# Altium project Motor Driver Board 2019-2020.PrjPcb (part 3 of 3)

## Sheet Connectors and Inputs.SchDoc: Connectors and Inputs
size A4; Organization: UOE Racing; Address1: University of Ottawa; Address2: Camry M; Address3: &; Address4: Nick M; DocumentNumber: 2020; Revision: A; SheetNumber: 4; SheetTotal: 4
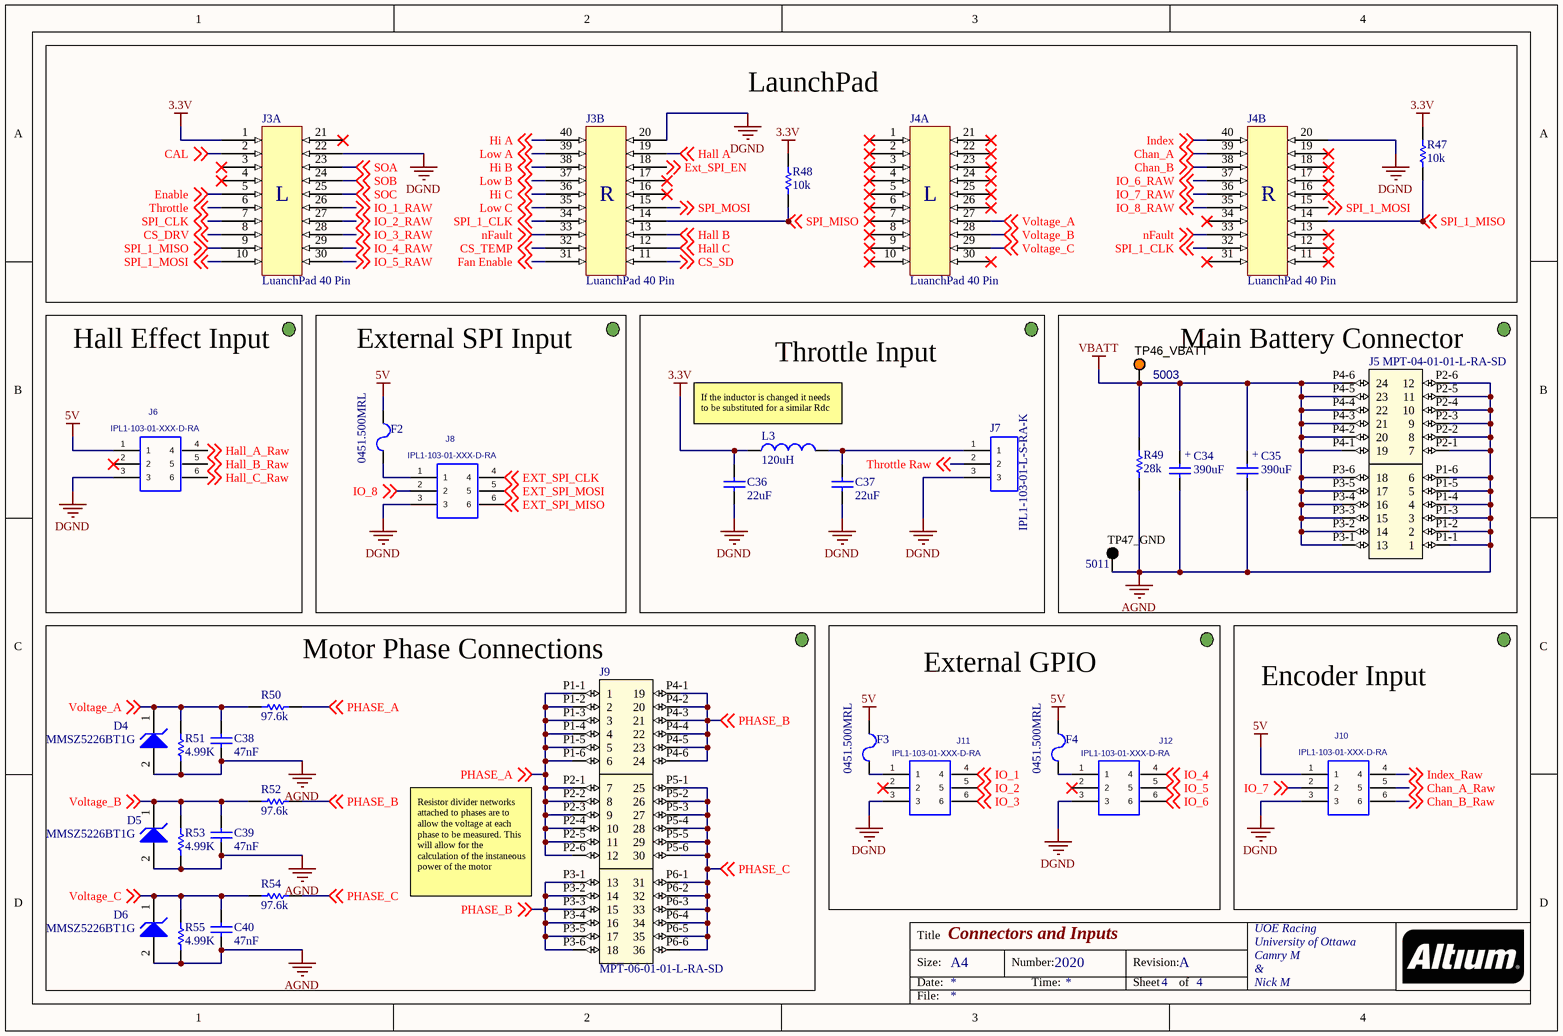
[diagram p2: Connectors and Inputs.SchDoc]

### Parts
C34  390uF  [EGPD800ELL391MK25H]
C35  390uF  [EGPD800ELL391MK25H]
C36  22uF  [CAPC2013X145X50ML20T25]
C37  22uF  [CAPC2013X145X50ML20T25]
C38  47nF  [CAPC1608X05L]
C39  47nF  [CAPC1608X05L]
C40  47nF  [CAPC1608X05L]
D4  MMSZ5226BT1G  [ONSC-SOD-123-2-425-04_V]
D5  MMSZ5226BT1G  [ONSC-SOD-123-2-425-04_V]
D6  MMSZ5226BT1G  [ONSC-SOD-123-2-425-04_V]
F2  0451.500MRL  [LFUS-45X_V]
F3  0451.500MRL  [LFUS-45X_V]
F4  0451.500MRL  [LFUS-45X_V]
J3  LuanchPad 40 Pin  [TI LuanchPad]  (parts A,B of 2)
J4  LuanchPad 40 Pin  [TI LuanchPad]  (parts A,B of 2)
J5  MPT-04-01-01-L-RA-SD  [*MPT-04-01-XX-X-RA-SD]
J6  IPL1-103-01-XXX-D-RA  [IPL1-103-01-XXX-D-RA]
J7  IPL1-103-01-L-S-RA-K  [IPL1-103-01-XXX-S-RA]
J8  IPL1-103-01-XXX-D-RA  [IPL1-103-01-XXX-D-RA]
J9  MPT-06-01-01-L-RA-SD  [*MPT-06-01-XX-X-RA-SD]
J10  IPL1-103-01-XXX-D-RA  [IPL1-103-01-XXX-D-RA]
J11  IPL1-103-01-XXX-D-RA  [IPL1-103-01-XXX-D-RA]
J12  IPL1-103-01-XXX-D-RA  [IPL1-103-01-XXX-D-RA]
L3  120uH  [INDM125100X60N]
R47  10k  [CAPC1608X05L]
R48  10k  [CAPC1608X05L]
R49  28k  [CAPC1608X05L]
R50  97.6k  [RESC1608X55X30NL15T15]
R51  4.99K  [CAPC1608X05L]
R52  97.6k  [RESC1608X55X30NL15T15]
R53  4.99K  [CAPC1608X05L]
R54  97.6k  [RESC1608X55X30NL15T15]
R55  4.99K  [CAPC1608X05L]
TP46_VBATT  5003  [KSTN-5003]
TP47_GND  5011  [KSTN-5011_V]

### Blocks framed on the sheet
LaunchPad: J3 J4 R47 R48
Hall Effect Input: J6
External SPI Input: F2 J8
Throttle Input: C36 C37 J7 L3
Main Battery Connector: C34 C35 J5 R49 TP46_VBATT TP47_GND
Motor Phase Connections: C38-C40 D4-D6 J9 R50-R55
External GPIO: F3 F4 J11 J12
Encoder Input: J10

### Nets
3.3V: C36.2 J3.1 L3.1 R47.2 R48.2
5V: F2.2 F3.2 F4.2 J6.1 J10.1
AGND: C34.2 C35.2 C36.1 C37.1 C38.1 C39.1 C40.1 D4.2(A) D5.2(A) D6.2(A) J3.20 J3.22 J4.20 J5.P1-1(1) J5.P1-2(2) J5.P1-3(3) J5.P1-4(4) J5.P1-5(5) J5.P1-6(6) J5.P2-1(7) J5.P2-2(8) J5.P2-3(9) J5.P2-4(10) J5.P2-5(11) J5.P2-6(12) J6.3 J7.3 J8.3 J10.3 J11.3 J12.3 R49.1 R51.1 R53.1 R55.1 TP47_GND.1  [also labelled DGND]
VBATT: C34.1 C35.1 J5.P3-1(13) J5.P3-2(14) J5.P3-3(15) J5.P3-4(16) J5.P3-5(17) J5.P3-6(18) J5.P4-1(19) J5.P4-2(20) J5.P4-3(21) J5.P4-4(22) J5.P4-5(23) J5.P4-6(24) R49.2 TP46_VBATT.1
CAL: J3.2 ; off-sheet CAL
Chan_A: J4.39 ; off-sheet Chan_A
Chan_A_Raw: J10.5 ; off-sheet Chan_A_Raw
Chan_B: J4.38 ; off-sheet Chan_B
Chan_B_Raw: J10.6 ; off-sheet Chan_B_Raw
CS_DRV: J3.8 ; off-sheet CS_DRV
CS_SD: J3.11 ; off-sheet CS_SD
CS_TEMP: J3.32 ; off-sheet CS_TEMP
Enable: J3.5 ; off-sheet Enable
EXT_SPI_CLK: J8.4 ; off-sheet EXT_SPI_CLK
Ext_SPI_EN: J3.18 ; off-sheet Ext_SPI_EN
EXT_SPI_MISO: J8.6 ; off-sheet EXT_SPI_MISO
EXT_SPI_MOSI: J8.5 ; off-sheet EXT_SPI_MOSI
Fan Enable: J3.31 ; off-sheet Fan Enable
Hall A: J3.19 ; off-sheet Hall A
Hall B: J3.13 ; off-sheet Hall B
Hall C: J3.12 ; off-sheet Hall C
Hall_A_Raw: J6.4 ; off-sheet Hall_A_Raw
Hall_B_Raw: J6.5 ; off-sheet Hall_B_Raw
Hall_C_Raw: J6.6 ; off-sheet Hall_C_Raw
Hi A: J3.40 ; off-sheet Hi A
Hi B: J3.38 ; off-sheet Hi B
Hi C: J3.36 ; off-sheet Hi C
Index: J4.40 ; off-sheet Index
Index_Raw: J10.4 ; off-sheet Index_Raw
IO_1: J11.4 ; off-sheet IO_1
IO_1_RAW: J3.26 ; off-sheet IO_1_RAW
IO_2: J11.5 ; off-sheet IO_2
IO_2_RAW: J3.27 ; off-sheet IO_2_RAW
IO_3: J11.6 ; off-sheet IO_3
IO_3_RAW: J3.28 ; off-sheet IO_3_RAW
IO_4: J12.4 ; off-sheet IO_4
IO_4_RAW: J3.29 ; off-sheet IO_4_RAW
IO_5: J12.5 ; off-sheet IO_5
IO_5_RAW: J3.30 ; off-sheet IO_5_RAW
IO_6: J12.6 ; off-sheet IO_6
IO_6_RAW: J4.37 ; off-sheet IO_6_RAW
IO_7: J10.2 ; off-sheet IO_7
IO_7_RAW: J4.36 ; off-sheet IO_7_RAW
IO_8: J8.2 ; off-sheet IO_8
IO_8_RAW: J4.35 ; off-sheet IO_8_RAW
Low A: J3.39 ; off-sheet Low A
Low B: J3.37 ; off-sheet Low B
Low C: J3.35 ; off-sheet Low C
nFault: J3.33 J4.33 ; off-sheet nFault
PHASE_A: J9.P1-1(1) J9.P1-2(2) J9.P1-3(3) J9.P1-4(4) J9.P1-5(5) J9.P1-6(6) J9.P2-1(7) J9.P2-2(8) J9.P2-3(9) J9.P2-4(10) J9.P2-5(11) J9.P2-6(12) R50.2 ; off-sheet PHASE_A
PHASE_B: J9.P3-1(13) J9.P3-2(14) J9.P3-3(15) J9.P3-4(16) J9.P3-5(17) J9.P3-6(18) J9.P4-1(19) J9.P4-2(20) J9.P4-3(21) J9.P4-4(22) J9.P4-5(23) J9.P4-6(24) R52.2 ; off-sheet PHASE_B
PHASE_C: J9.P5-1(25) J9.P5-2(26) J9.P5-3(27) J9.P5-4(28) J9.P5-5(29) J9.P5-6(30) J9.P6-1(31) J9.P6-2(32) J9.P6-3(33) J9.P6-4(34) J9.P6-5(35) J9.P6-6(36) R54.2 ; off-sheet PHASE_C
SOA: J3.23 ; off-sheet SOA
SOB: J3.24 ; off-sheet SOB
SOC: J3.25 ; off-sheet SOC
SPI_1_CLK: J3.34 J4.32 ; off-sheet SPI_1_CLK
SPI_1_MISO: J3.9 J4.14 R47.1 ; off-sheet SPI_1_MISO
SPI_1_MOSI: J3.10 J4.15 ; off-sheet SPI_1_MOSI
SPI_CLK: J3.7 ; off-sheet SPI_CLK
SPI_MISO: J3.14 R48.1 ; off-sheet SPI_MISO
SPI_MOSI: J3.15 ; off-sheet SPI_MOSI
Throttle: J3.6 ; off-sheet Throttle
Throttle Raw: J7.2 ; off-sheet Throttle Raw
Voltage_A: C38.2 D4.1(K) J4.27 R50.1 R51.2 ; off-sheet Voltage_A
Voltage_B: C39.2 D5.1(K) J4.28 R52.1 R53.2 ; off-sheet Voltage_B
Voltage_C: C40.2 D6.1(K) J4.29 R54.1 R55.2 ; off-sheet Voltage_C
NetC37_2: C37.2 J7.1 L3.2
NetF2_1: F2.1 J8.1
NetF3_1: F3.1 J11.1
NetF4_1: F4.1 J12.1

Not connected (* = marked no-connect by the designer): J3 3* 4* 16* 17* 21*; J4 1* 2* 3* 4* 5* 6* 7* 8* 9* 10* 11* 12* 13* 16* 17* 18* 19* 21* 22* 23* 24* 25* 26* 30* 31* 34*; J6 2*; J11 2*; J12 2*

### Notes on the sheet
- (near L3) If the inductor is changed it needs to be substituted for a similar Rdc
- Resistor divider networks attached to phases are to allow the voltage at each phase to be measured. This will allow for the calculation of the instaneous power of the motor
- Title
- Size:
- Date:
- A4
- Number:
- Time:
- Revision:
- Sheet
- of
- File:
- (in symbol EGPD800ELL391MK25H) +
- (in symbol LuanchPad 40 Pin, part A) L
- (in symbol LuanchPad 40 Pin, part B) R

### Library data of the parts
C34 C35 = EGPD800ELL391MK25H: CAP ALUM 390UF 20% 80V RADIAL; Manufacturer 1: United Chemi-Con; ESR (Equivalent Series Resistance): 52mR; Ripple Current: 2.05A; Life (Hours): 3000Hour; Lead/Base Style: Straight; Supplier 1: Digi-Key; Manufacturer Part Number 1: EGPD800ELL391MK25H; Stock 1: 4261; Pricing 1: 1=1.62000, 10=1.28300, 100=0.96200, 500=0.72684, 1000=0.64133, 2500=0.59857, 5000=0.58147 (USD); RoHS: Yes; Mount: Through Hole; Case/Package: Radial; Min Operating Temperature: -40°C; Max Operating Temperature: 135°C; Capacitance: 390uF; Package Quantity: 1000; Packaging: Bulk; Voltage Rating: 80V; Tolerance: 20%; Termination: Radial; Voltage Rating (DC): 80V; Diameter: 12.5mm; Length: 25mm; Height: 12.5mm; Lead Pitch: 0.197inch; Height - Seated (Max): 1.043inch; Width: 12.5mm; ComponentLink1URL: https://datasheet.ciiva.com/31836/76cat-db-al-cgieejppdfnamegpd-cgieejppdfnamegpd-31836902.pdf?src-supplier=Onlinecomponents.com; ComponentLink1Description: https://datasheet.ciiva.com/31836/76cat-db-al-cgieejppdfnamegpd-cgieejppdfnamegpd-31836902.pdf?src-supplier=Onlinecomponents.com; ClassName: FETBridge
C36 C37 = CMP-2007-01021-1: Part Number: C0805C226M9PAC7800; Manufacturer: Kemet; ClassName: Throttle
C38-C40 = C0603C473K5RACTU: Multilayer Ceramic Capacitor, C Series, 0.047 - F, - 10%, X7R, 50 V, 0603 [1608 Metric] ;RoHS Compliant: Yes; Manufacturer 1: KEMET; Voltage Rating: 50V; Dissipation Factor: 2.5%; Supplier 1: Digi-Key; Manufacturer Part Number 1: C0603C473K5RACTU; Stock 1: 340857; Pricing 1: 1=0.12000, 10=0.08800, 100=0.04130, 500=0.02896, 1000=0.02397 (USD); RoHS: Yes; Mount: Surface Mount,PCB; Case/Package: 0603; Number of Pins: 2; Case Code (Metric): 1608; Case Code (Imperial): 0603; Dielectric Material: Ceramic; Min Operating Temperature: -55°C; Max Operating Temperature: 125°C; Packaging: Tape and Reel; Tolerance: 10%; Package Quantity: 1; Capacitance: 47nF; Voltage Rating (DC): 50V; Dielectric: X7R; Termination: SMD/SMT; Voltage: 50V; Length: 1.6mm; Height: 0.8mm; Width: 0.8mm; Thickness: 0.034inch; Lead Pitch: 0.7mm; Depth: 0.8mm; Radiation Hardening: No; REACH SVHC: No SVHC; ComponentLink1URL: https://datasheet.ciiva.com/6074/1776093-6074329.pdf?src-supplier=Farnell; ComponentLink1Description: https://datasheet.ciiva.com/6074/1776093-6074329.pdf?src-supplier=Farnell; ComponentLink2URL: https://datasheet.ciiva.com/28682/1851736-28682298.pdf?src-supplier=Element14; ComponentLink2Description: https://datasheet.ciiva.com/28682/1851736-28682298.pdf?src-supplier=Element14; ComponentLink3URL: https://datasheet.ciiva.com/7823/1776093-7823803.pdf?src-supplier=Element14; ComponentLink3Description: https://datasheet.ciiva.com/7823/1776093-7823803.pdf?src-supplier=Element14; ComponentLink4URL: https://datasheet.ciiva.com/18193/getdatasheetpartid-94279-18193115.pdf?src-supplier=Verical; ComponentLink4Description: https://datasheet.ciiva.com/18193/getdatasheetpartid-94279-18193115.pdf?src-supplier=Verical; ComponentLink5URL: https://datasheet.ciiva.com/7823/1776093-7823804.pdf?src-supplier=Element14; ComponentLink5Description: https://datasheet.ciiva.com/7823/1776093-7823804.pdf?src-supplier=Element14; ClassName: Vfeedback
D4-D6 = CMP-1060-00363-1: Zener Voltage Regulator, 500 mW, 2-Pin SOD-123, Pb-Free, Tape and Reel; Manufacturer: On Semiconductor; P Max (W): 0.5; VZ Typ (V): 3.3; PartNumber: MMSZ5226BT1G; ComponentLink1Description: Manufacturer URL; ComponentLink3URL: http://www.onsemi.com/pub_link/Collateral/425-04.PDF; ComponentLink3Description: Package Specification; ComponentLink2Description: Datasheet; ComponentLink1URL: http://www.onsemi.com/; Mounting Technology: Surface Mount; Packing: Tape and Reel; PackageDescription: 2-Pin SOD, Body 1.6 x 2.69 mm; ComponentLink2URL: http://www.onsemi.com/pub_link/Collateral/MMSZ5221BT1-D.PDF; RoHS: Pb-Free; PackageVersion: Rev. G, 10/2009; PackageReference: SOD-123-2-425-04; DatasheetVersion: Rev. 12; ClassName: Vfeedback
F2-F4 = CMP-2000-05631-1: Fuse, 125 V, 500 mA, -55 to 125 degC, 2-Pin SMD, RoHS, Tape and Reel; Manufacturer: Littelfuse; Working Voltage-Max: 125V; Response Characteristic: VeryFastActing; Current Rating: 0.5A; Datasheet Version: 02/2016; Package Description: 2-Pin Surface Mount Device, Body 6.1 x 2.69 mm; Package Reference: 45X; Manufacturer URL: http://www.littelfuse.com/; Mounting Technology: SurfaceMount; Size: 6.10x2.69mm; Operating Temp Range: -55to+125°C; Datasheet URL: http://www.littelfuse.com/products/fuses/surface-mount-fuses/nano-2-fuses/~/media/electronics/datasheets/fuses/littelfuse_fuse_451_453_datasheet.pdf.pdf
J3 J4 = LuanchPad 40 Pin: Designed to fit a TI luanchpad board or expansion board
J5 = MPT-04-01-01-L-RA-SD: SAMTEC - MPT-04-01-01-L-RA-SD - HEADER, 4WAY, POWER, R/A; Current Rating: 34.8A; Voltage Rating: 848V; Number of Contacts: 4; Number of Ports: 1; Max Voltage Rating (AC): 600V; Gender: Male; Pitch: 5mm; Supplier 1: Digi-Key; Manufacturer 1: Samtec; Manufacturer Part Number 1: MPT-04-01-01-L-RA-SD; Stock 1: 186; Pricing 1: 1=5.98000, 48=5.25792, 144=4.78000, 528=4.06299, 1008=3.46550 (USD); RoHS: Yes; Mount: Through Hole; Contact Plating: Gold; Contact Material: Copper Alloy,Copper; Number of Terminals: 32; Housing Material: Polymer; Min Operating Temperature: -55°C; Max Operating Temperature: 125°C; Number of Rows: 1; Packaging: Bulk; Termination: Solder; Orientation: Right Angle; Length: 31.36mm; Lead Pitch: 5mm; Depth: 14.81mm; Radiation Hardening: No; REACH SVHC: No SVHC; ComponentLink1URL: https://datasheet.ciiva.com/7997/452746-7997632.pdf?src-supplier=Element14; ComponentLink1Description: https://datasheet.ciiva.com/7997/452746-7997632.pdf?src-supplier=Element14; ComponentLink2URL: https://datasheet.ciiva.com/25617/0900766b81157edd-25617154.pdf?src-supplier=RSComponents; ComponentLink2Description: https://datasheet.ciiva.com/25617/0900766b81157edd-25617154.pdf?src-supplier=RSComponents; ComponentLink3URL: https://datasheet.ciiva.com/9446/mps-ra-9446008.pdf?src-supplier=Avnet; ComponentLink3Description: https://datasheet.ciiva.com/9446/mps-ra-9446008.pdf?src-supplier=Avnet; ClassName: FETBridge
J6 J8 J10-J12 = IPL1-103-01-XXX-D-RA: Terminal Assembly, Double Row, Right Angle, Thru-Hole, 0.100" x 0.100" Pitch, 6Pins; MANUFACTURER: SAMTEC; CREATED: July 16, 2014 - Wendy Xin; PCB DECAL: IPL1-103-01-XXX-D-RA
J7 = IPL1-103-01-L-S-RA-K: CONN HEADER R/A 3POS 2.54MM; Manufacturer 1: Samtec; Max Current Rating: 7.4A; Number of Contacts: 3; Number of Ports: 1; Max Voltage Rating (AC): 675V; Gender: Male; Supplier 1: Digi-Key; Manufacturer Part Number 1: IPL1-103-01-L-S-RA-K; Stock 1: 209; Pricing 1: 1=2.59000, 10=2.34700, 100=2.01180, 500=1.67650, 1000=1.43700, 5000=1.27414 (USD); RoHS: Yes; Mount: Through Hole; Contact Material: Bronze; Contact Plating: Gold; Number of Terminals: 3; Housing Material: Polymer; Min Operating Temperature: -55°C; Max Operating Temperature: 125°C; Termination: Solder; Orientation: Right Angle; Packaging: Bulk; Length: 9.14mm; Pitch: 2.54mm; Depth: 9.65mm; Radiation Hardening: No; ComponentLink1URL: http://www.farnell.com/datasheets/2607185.pdf?src-supplier=Farnell; ComponentLink1Description: http://www.farnell.com/datasheets/2607185.pdf?src-supplier=Farnell; ComponentLink2URL: http://components.arrow.com/part/dataview/0323_03818136?src-supplier=Arrow+Europe; ComponentLink2Description: http://components.arrow.com/part/dataview/0323_03818136?src-supplier=Arrow+Europe; ComponentLink3URL: http://www.samtec.com/documents/webfiles/pdf/ipl1.pdf?src-supplier=Avnet+Europe; ComponentLink3Description: http://www.samtec.com/documents/webfiles/pdf/ipl1.pdf?src-supplier=Avnet+Europe; ComponentLink4URL: http://www.samtec.com/documents/webfiles/pdf/ipl1.pdf?src-supplier=Avnet; ComponentLink4Description: http://www.samtec.com/documents/webfiles/pdf/ipl1.pdf?src-supplier=Avnet; ComponentLink5URL: http://www.farnell.com/datasheets/2607185.pdf?src-supplier=Newark; ComponentLink5Description: http://www.farnell.com/datasheets/2607185.pdf?src-supplier=Newark; ComponentLink6URL: http://suddendocs.samtec.com/prints/ipl1-1xx-xx-xxx-s-xx-x-xx-mkt.pdf?src-supplier=Digi-Key; ComponentLink6Description: http://suddendocs.samtec.com/prints/ipl1-1xx-xx-xxx-s-xx-x-xx-mkt.pdf?src-supplier=Digi-Key
J9 = MPT-06-01-01-L-RA-SD: Conn Mini-Power Terminal Strip HDR 6 POS Solder RA Thru-Hole 36 Terminal 1 Port; pin to pad: P1-1>1 P1-2>2 P1-3>3 P1-4>4 P1-5>5 P1-6>6 P2-1>7 P2-2>8 P2-3>9 P2-4>10 P2-5>11 P2-6>12 P3-1>13 P3-2>14 P3-3>15 P3-4>16 P3-5>17 P3-6>18 P4-1>19 P4-2>20 P4-3>21 P4-4>22 P4-5>23 P4-6>24 P5-1>25 P5-2>26 P5-3>27 P5-4>28 P5-5>29 P5-6>30 P6-1>31 P6-2>32 P6-3>33 P6-4>34 P6-5>35 P6-6>36; Manufacturer 1: Samtec; Number of Contacts: 6; Voltage Rating: 848V; Number of Ports: 1; Max Voltage Rating (AC): 600V; Gender: Male; Pitch: 5mm; Supplier 1: Digi-Key; Manufacturer Part Number 1: MPT-06-01-01-L-RA-SD; Stock 1: 373; Pricing 1: 1=7.27000, 48=6.36292, 144=5.75701, 528=4.84799, 1008=4.24200 (USD); RoHS: Yes; Mount: Through Hole; Contact Material: Copper Alloy,Copper; Contact Plating: Gold; Number of Terminals: 36; Housing Material: Polymer; Min Operating Temperature: -55°C; Max Operating Temperature: 125°C; Termination: Solder; Orientation: Right Angle; Packaging: Bulk; Number of Rows: 1; Lead Pitch: 5mm; Depth: 14.81mm; Radiation Hardening: No; REACH SVHC: No SVHC; ComponentLink1URL: https://datasheet.ciiva.com/25617/0900766b81157edd-25617181.pdf?src-supplier=RSComponents; ComponentLink1Description: https://datasheet.ciiva.com/25617/0900766b81157edd-25617181.pdf?src-supplier=RSComponents; ComponentLink2URL: https://datasheet.ciiva.com/16677/mps-ra-16677806.pdf?src-supplier=Avnet+Europe; ComponentLink2Description: https://datasheet.ciiva.com/16677/mps-ra-16677806.pdf?src-supplier=Avnet+Europe
L3 = DR125-124-R: Fixed Inductors 120 000uH 0.069A 150ohms; Manufacturer 1: Eaton Bussmann; Core Material: Ferrite; Tolerance: 20%; Shielding: Shielded; Saturation Current: 58A; Current Rating: 60mA; Inductance: 120mH; DC Resistance (DCR): 150R; Test Frequency: 100kHz; Current: 60A; Max DC Current: 69mA; Supplier 1: Digi-Key; Manufacturer Part Number 1: DR125-124-R; Stock 1: 1520; Pricing 1: 1=1.95000, 10=1.80100, 100=1.26060 (USD); RoHS: Yes; Mount: Surface Mount; Case/Package: 120; Number of Pins: 2; Weight: 0.016oz; Min Operating Temperature: -40°C; Max Operating Temperature: 125°C; Packaging: Tape and Reel; Package Quantity: 600; Termination: SMD/SMT; DC Current: 60mA; Military Standard: Not; Length: 12.5mm; Height: 6mm; Width: 0.492inch; Depth: 12.5mm; Lead Free: Lead Free; ComponentLink1URL: https://datasheet.ciiva.com/16291/4a32919a-7470-4ae0-be45-b59e3a1351ef-16291744.pdf?src-supplier=Future+Electronics; ComponentLink1Description: https://datasheet.ciiva.com/16291/4a32919a-7470-4ae0-be45-b59e3a1351ef-16291744.pdf?src-supplier=Future+Electronics; ComponentLink2URL: https://datasheet.ciiva.com/4958/bus-elx-ds-4315-dr-series-4958109.pdf?src-supplier=Mouser; ComponentLink2Description: https://datasheet.ciiva.com/4958/bus-elx-ds-4315-dr-series-4958109.pdf?src-supplier=Mouser
R47 R48 = RR0816P-103-D: RES SMD 10K OHM 0.5% 1/16W 0816; Manufacturer: Susumu; Resistance: 10kR; Power Rating: 63mW; Voltage Rating: 75V; Temperature Coefficient: 25ppm/°C; Supplier 1: Digi-Key; Manufacturer Part Number: RR0816P-103-D; Stock 1: 1031099; Pricing 1: 1=0.11, 10=0.098, 100=0.0376, 1000=0.01654, 2500=0.01428 (USD); Case/Package: 0603; Number of Pins: 2; Weight: 7.1E-05oz; Case Code (Imperial): 0603; Case Code (Metric): 1608; Min Operating Temperature: -55°C; Max Operating Temperature: 125°C; Packaging: Tape and Reel; Tolerance: 0.5%; Package Quantity: 1; Termination: SMD/SMT; Composition: Thin Film; Number of Terminations: 2; Max Power Dissipation: 63mW; Voltage Rating (DC): 75V; Length: 1.6mm; Height: 0.4mm; Width: 0.8mm; Depth: 0.8mm; REACH SVHC: Unknown; Lead Free: Lead Free; ComponentLink1URL: http://documents.rs-components.com/techlib://itc_doclist_GB.htm?stockno=3915321; ComponentLink1Description: http://documents.rs-components.com/techlib://itc_doclist_GB.htm?stockno=3915321; ComponentLink2URL: http://www.susumu.co.jp/common/pdf/n_catalog_partition05_en.pdf; ComponentLink2Description: http://www.susumu.co.jp/common/pdf/n_catalog_partition05_en.pdf
R49 = RMCF0603FT28K0: RES SMD 28K OHM 1% 1/10W 0603; Manufacturer 1: Stackpole Electronics; Resistance: 28kR; Power Rating: 100mW; Temperature Coefficient: 100ppm/°C; Supplier 1: Digi-Key; Manufacturer Part Number 1: RMCF0603FT28K0; Stock 1: 126187; Pricing 1: 1=0.10000, 10=0.01700, 100=0.00680, 1000=0.00306, 2500=0.00266 (USD); RoHS: Yes; Mount: Surface Mount; Case/Package: 0603; Case Code (Metric): 1608; Case Code (Imperial): 0603; Contact Plating: Tin,Matte; Min Operating Temperature: -55°C; Max Operating Temperature: 155°C; Tolerance: 1%; Packaging: Tape and Reel; Composition: Thick Film; Number of Terminations: 2; Max Power Dissipation: 100mW; Features: Automotive AEC-Q200; Length: 0.061inch; Height: 0.022inch; Width: 0.031inch; Radiation Hardening: No; Lead Free: Lead Free; ComponentLink1URL: https://www.seielect.com/Catalog/SEI-RMCF_RMCP.pdf?src-supplier=Digi-Key; ComponentLink1Description: https://www.seielect.com/Catalog/SEI-RMCF_RMCP.pdf?src-supplier=Digi-Key; ComponentLink2URL: https://www.seielect.com/catalog/SEI-Packaging.pdf?src-supplier=Digi-Key; ComponentLink2Description: https://www.seielect.com/catalog/SEI-Packaging.pdf?src-supplier=Digi-Key; ComponentLink3URL: http://components.arrow.com/part/dataview/50505137S2698N1174?src-supplier=Arrow; ComponentLink3Description: http://components.arrow.com/part/dataview/50505137S2698N1174?src-supplier=Arrow; ComponentLink4URL: https://www.seielect.com/catalog/SEI-RMCF_RMCP.pdf?src-supplier=Avnet; ComponentLink4Description: https://www.seielect.com/catalog/SEI-RMCF_RMCP.pdf?src-supplier=Avnet; ComponentLink5URL: http://www.seielect.com/Catalog/SEI-RMC.pdf?src-supplier=Future+Electronics; ComponentLink5Description: http://www.seielect.com/Catalog/SEI-RMC.pdf?src-supplier=Future+Electronics
R50 R52 R54 = CMP-2000-00697-1: Manufacturer: Panasonic; Part Number: ERJ-3EKF9762V; ClassName: Vfeedback
R51 R53 R55 = RT0603BRD074K99L: RES SMD 4.99K OHM 0.1% 1/10W; Manufacturer 1: Yageo; Resistance: 4.99kR; Temperature Coefficient: 25ppm/°C; Power Rating: 100mW; Voltage Rating: 75V; Voltage Rating (DC): 50V; Supplier 1: Digi-Key; Manufacturer Part Number 1: RT0603BRD074K99L; Stock 1: 53078; Pricing 1: 1=0.37000, 10=0.31200, 100=0.12190, 1000=0.05103, 2500=0.04678 (USD); RoHS: Yes; Case/Package: 0603; Weight: 7.1E-05oz; Contact Plating: Tin,Matte; Case Code (Metric): 1608; Case Code (Imperial): 0603; Min Operating Temperature: -55°C; Max Operating Temperature: 125°C; Tolerance: 0.1%; Composition: Thin Film; Package Quantity: 5000; Packaging: Tape and Reel; Number of Terminations: 2; Termination: SMD/SMT; Military Standard: Not; Max Power Dissipation: 100mW; Features: Moisture Resistant; Length: 1.6mm; Height: 0.022inch; Width: 0.031inch; Depth: 0.8mm; Radiation Hardening: No; Lead Free: Lead Free; ComponentLink1URL: https://datasheet.ciiva.com/2585/pyu-rt-1-to-0-05-rohs-l-4-2585984.pdf?src-supplier=Digi-Key; ComponentLink1Description: https://datasheet.ciiva.com/2585/pyu-rt-1-to-0-05-rohs-l-4-2585984.pdf?src-supplier=Digi-Key; ComponentLink2URL: https://datasheet.ciiva.com/46635/pyu-rt-1-to-0-05-rohs-l-5-46635030.pdf?src-supplier=Digi-Key; ComponentLink2Description: https://datasheet.ciiva.com/46635/pyu-rt-1-to-0-05-rohs-l-5-46635030.pdf?src-supplier=Digi-Key; ComponentLink3URL: https://datasheet.ciiva.com/12836/pyu-rt-1-to-0-05-rohs-l-4-12836462.pdf?src-supplier=Mouser; ComponentLink3Description: https://datasheet.ciiva.com/12836/pyu-rt-1-to-0-05-rohs-l-4-12836462.pdf?src-supplier=Mouser; ClassName: Vfeedback
TP46_VBATT = CMP-1672-00009-1: Test Point, Orange, 1-Pin THD, RoHS; Peak Reverse Current: 600 uA; Forward Current: 3 A; Max Surge Current: 80 A; Forward Voltage: 1.08 V; Max Operating Temperature: 150 degC; PackageReference: 5003; Pins: 2; ComponentLink2URL: http://keyelco.com/userAssets/file/M65p56.pdf; PackageDescription: 1-Pin Through Hole Device, Dia 2.54 mm; Weight: 0.01 lb; Diameter: 5.3 mm; Mount: Through Hole; Package Quantity: 500; Packaging: Bulk; Min Operating Temperature: -65 degC; ComponentLink1Description: Manufacturer URL; Height: 0.25 inch; ComponentLink1URL: http://www.keyelco.com/; ComponentLink2Description: Datasheet; Width: 0.25 inch; REACH SVHC: No SVHC; RoHSCompliant: true; Radiation Hardening: No; Length: 9.5 mm; DatasheetVersion: Jun-15
TP47_GND = CMP-1672-00003-4: Test Point, Black, Through Hole, RoHS, Bulk; Manufacturer: Keystone; ComponentLink2URL: http://www.keyelco.com/product-pdf.cfm?p=1320; Colour: Black; Pins: 1; REACH SVHC: No SVHC; ComponentLink1URL: http://www.keyelco.com/; PackageReference: 5011; Contact Plating: Silver; Package Quantity: 100; Packaging: Bulk; RoHSCompliant: true; Height: 8.12 mm; PackageDescription: 1-Pin Through Hole Device, Dia 3.17 mm; Mount: Through Hole; Mounting Technology: Through Hole; DatasheetVersion: Rev. F, 12/2013; ComponentLink1Description: Manufacturer URL; Contact Material: Bronze; ComponentLink2Description: Datasheet

## Sheet Title Page.SchDoc: Title Page
size A; Organization: UOE Racing; Address1: University of Ottawa; Address2: Camry M; Address3: &; Address4: Nick M; DocumentNumber: 2020; Revision: A; SheetNumber: 1; SheetTotal: 4
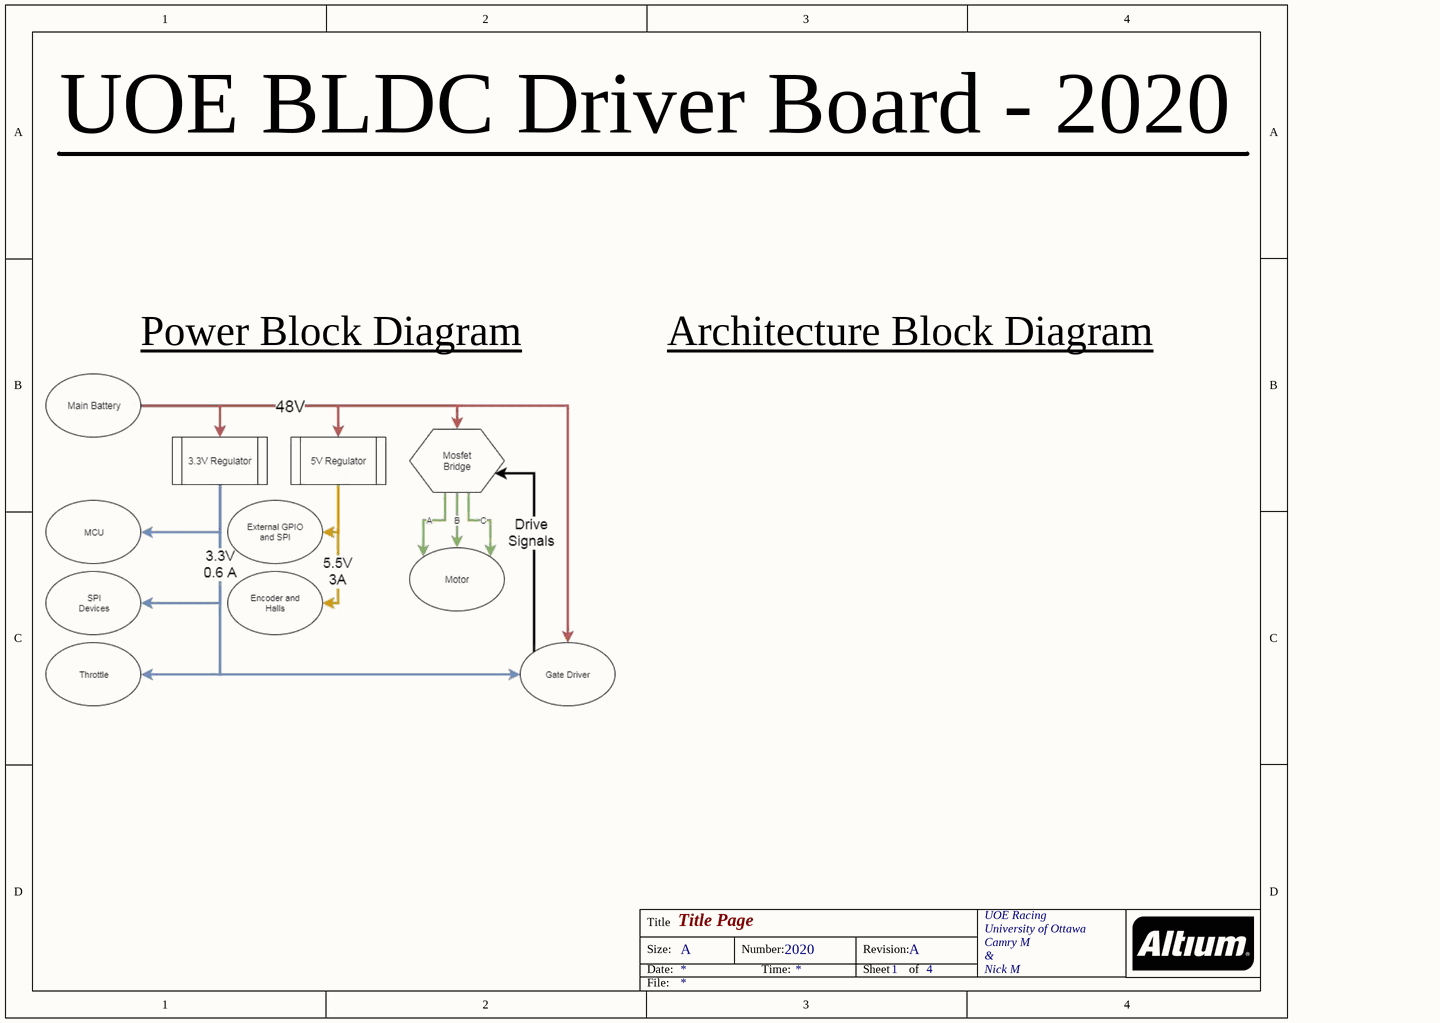
[diagram p3: Title Page.SchDoc]

### Notes on the sheet
- UOE BLDC Driver Board - 2020
- Power Block Diagram
- Architecture Block Diagram
- Title
- Size:
- Date:
- A
- Number:
- Time:
- Revision:
- Sheet
- of
- File:

## Nets that join several sheets
3.3V: Gate Driver and Power Section (13 pins), MCU and Digital Interfaces (17 pins), Connectors and Inputs (5 pins)
5V: Gate Driver and Power Section (11 pins), MCU and Digital Interfaces (13 pins), Connectors and Inputs (5 pins)
AGND: Gate Driver and Power Section (49 pins), MCU and Digital Interfaces (33 pins), Connectors and Inputs (36 pins)
VBATT: Gate Driver and Power Section (18 pins), Connectors and Inputs (16 pins)
CAL: Gate Driver and Power Section (R26.2 R43.1 U8.34), Connectors and Inputs (J3.2)
Chan_A_Raw: MCU and Digital Interfaces (U2.3), Connectors and Inputs (J10.5)
Chan_B_Raw: MCU and Digital Interfaces (U2.6), Connectors and Inputs (J10.6)
CS_DRV: Gate Driver and Power Section (R19.1 U8.32), Connectors and Inputs (J3.8)
CS_SD: Gate Driver and Power Section (R44.2), Connectors and Inputs (J3.11)
CS_TEMP: Gate Driver and Power Section (R20.1 U9.1), Connectors and Inputs (J3.32)
Enable: Gate Driver and Power Section (R18.2 R45.1 U8.33), MCU and Digital Interfaces (EN.1), Connectors and Inputs (J3.5)
EXT_SPI_CLK: MCU and Digital Interfaces (U5.13), Connectors and Inputs (J8.4)
Ext_SPI_EN: MCU and Digital Interfaces (R12.2 R13.1 U5.8), Connectors and Inputs (J3.18)
EXT_SPI_MISO: MCU and Digital Interfaces (U5.11), Connectors and Inputs (J8.6)
EXT_SPI_MOSI: MCU and Digital Interfaces (U5.12), Connectors and Inputs (J8.5)
Fan Enable: Gate Driver and Power Section (Q11.1 R42.2), Connectors and Inputs (J3.31)
Hall A: MCU and Digital Interfaces (HALLA.1 U7.3), Connectors and Inputs (J3.19)
Hall B: MCU and Digital Interfaces (HALLB.1 U7.6), Connectors and Inputs (J3.13)
Hall C: MCU and Digital Interfaces (HALLC.1 U7.8), Connectors and Inputs (J3.12)
Hall_A_Raw: MCU and Digital Interfaces (R14.1 U6.1), Connectors and Inputs (J6.4)
Hall_B_Raw: MCU and Digital Interfaces (R15.1 U6.3), Connectors and Inputs (J6.5)
Hall_C_Raw: MCU and Digital Interfaces (R16.1 U6.6), Connectors and Inputs (J6.6)
Hi A: Gate Driver and Power Section (U8.37), MCU and Digital Interfaces (HIA.1), Connectors and Inputs (J3.40)
Hi B: Gate Driver and Power Section (U8.39), MCU and Digital Interfaces (HIB.1), Connectors and Inputs (J3.38)
Hi C: Gate Driver and Power Section (U8.41), MCU and Digital Interfaces (HIC.1), Connectors and Inputs (J3.36)
Index_Raw: MCU and Digital Interfaces (U2.1), Connectors and Inputs (J10.4)
IO_1: MCU and Digital Interfaces (U3.20), Connectors and Inputs (J11.4)
IO_1_RAW: MCU and Digital Interfaces (U3.1), Connectors and Inputs (J3.26)
IO_2: MCU and Digital Interfaces (U3.18), Connectors and Inputs (J11.5)
IO_2_RAW: MCU and Digital Interfaces (U3.3), Connectors and Inputs (J3.27)
IO_3: MCU and Digital Interfaces (U3.17), Connectors and Inputs (J11.6)
IO_3_RAW: MCU and Digital Interfaces (U3.4), Connectors and Inputs (J3.28)
IO_4: MCU and Digital Interfaces (U3.16), Connectors and Inputs (J12.4)
IO_4_RAW: MCU and Digital Interfaces (U3.5), Connectors and Inputs (J3.29)
IO_5: MCU and Digital Interfaces (U3.15), Connectors and Inputs (J12.5)
IO_5_RAW: MCU and Digital Interfaces (U3.6), Connectors and Inputs (J3.30)
IO_6: MCU and Digital Interfaces (U3.14), Connectors and Inputs (J12.6)
IO_6_RAW: MCU and Digital Interfaces (U3.7), Connectors and Inputs (J4.37)
IO_7: MCU and Digital Interfaces (U3.13), Connectors and Inputs (J10.2)
IO_7_RAW: MCU and Digital Interfaces (U3.8), Connectors and Inputs (J4.36)
IO_8: MCU and Digital Interfaces (U3.12), Connectors and Inputs (J8.2)
IO_8_RAW: MCU and Digital Interfaces (U3.9), Connectors and Inputs (J4.35)
Low A: Gate Driver and Power Section (U8.38), MCU and Digital Interfaces (LOWA.1), Connectors and Inputs (J3.39)
Low B: Gate Driver and Power Section (U8.40), MCU and Digital Interfaces (LOB.1), Connectors and Inputs (J3.37)
Low C: Gate Driver and Power Section (U8.42), MCU and Digital Interfaces (LOC.1), Connectors and Inputs (J3.35)
nFault: Gate Driver and Power Section (R21.1 R41.1 U8.28), MCU and Digital Interfaces (FLT.1), Connectors and Inputs (J3.33 J4.33)
PHASE_A: Gate Driver and Power Section (PHASE_A.1 Q4.S Q7.D U8.9), Connectors and Inputs (13 pins)
PHASE_B: Gate Driver and Power Section (5 pins), Connectors and Inputs (13 pins)
PHASE_C: Gate Driver and Power Section (PHASE_C.1 Q3.S Q6.D U8.19), Connectors and Inputs (13 pins)
SOA: Gate Driver and Power Section (U8.25), MCU and Digital Interfaces (SOA.1), Connectors and Inputs (J3.23)
SOB: Gate Driver and Power Section (U8.24), MCU and Digital Interfaces (SOB.1), Connectors and Inputs (J3.24)
SOC: Gate Driver and Power Section (U8.23), MCU and Digital Interfaces (SOC.1), Connectors and Inputs (J3.25)
SPI_1_CLK: MCU and Digital Interfaces (CLK1.1), Connectors and Inputs (J3.34 J4.32)
SPI_1_MISO: MCU and Digital Interfaces (MISO1.1), Connectors and Inputs (J3.9 J4.14 R47.1)
SPI_1_MOSI: MCU and Digital Interfaces (MOSI1.1), Connectors and Inputs (J3.10 J4.15)
SPI_CLK: Gate Driver and Power Section (U8.31 U9.3), MCU and Digital Interfaces (CLK.1), Connectors and Inputs (J3.7)
SPI_MISO: Gate Driver and Power Section (U8.29 U9.4), MCU and Digital Interfaces (MISO.1), Connectors and Inputs (J3.14 R48.1)
SPI_MOSI: Gate Driver and Power Section (U8.30), MCU and Digital Interfaces (MOSI.1), Connectors and Inputs (J3.15)
Throttle Raw: MCU and Digital Interfaces (R8.1 R11.1 THROTTLE_RAW.1), Connectors and Inputs (J7.2)
Voltage_A: MCU and Digital Interfaces (VC.1), Connectors and Inputs (5 pins)
Voltage_B: MCU and Digital Interfaces (VB.1), Connectors and Inputs (5 pins)
Voltage_C: MCU and Digital Interfaces (VA.1), Connectors and Inputs (5 pins)